# Altium project Lumos_Probe.PrjPcb
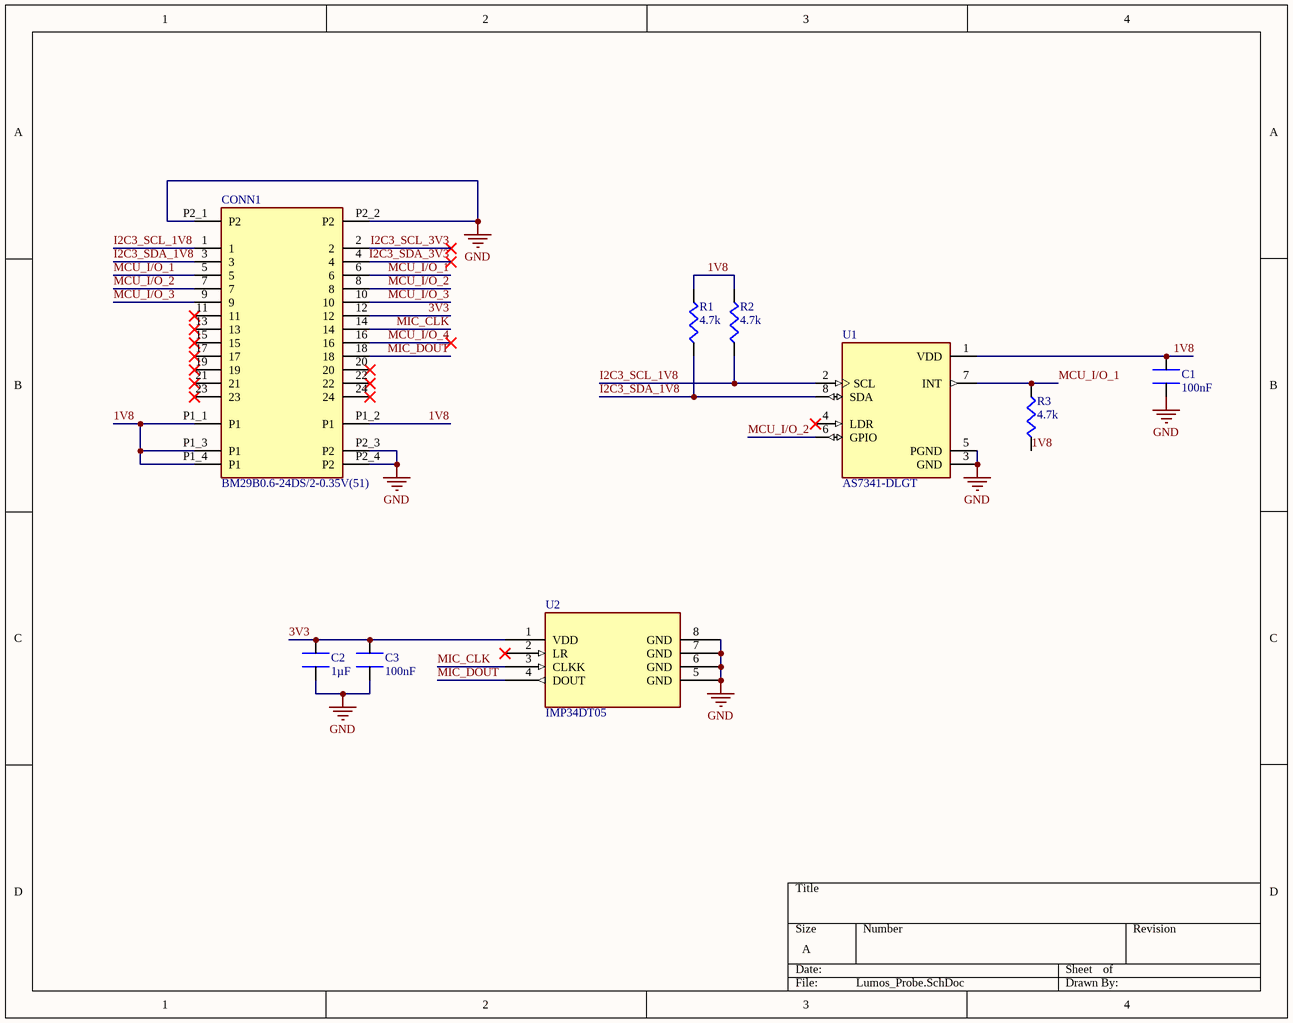
[diagram p0: Lumos_Probe.SchDoc]
1 sheet, 9 parts. Net scope: global (net labels, ports and power ports of the same name join across sheets).
Board file: Lumos_Probe.PcbDoc

## Sheet Lumos_Probe.SchDoc
size A; SheetNumber: 1; SheetTotal: 1

### Parts
C1  value 100nF  [Chip2PinSM127P600-8N]  (hidden comment: 0402YC104JAT4A)
C2  value 1µF  [Chip2PinSM127P600-8N]  (hidden comment: 0402YD105KAT4A)
C3  value 100nF  [Chip2PinSM127P600-8N]  (hidden comment: 0402YC104JAT4A)
CONN1  BM29B0.6-24DS/2-0.35V(51)  [BM29B0.6-24DS_2-0.35V(51)-Footprint-1]
R1  value 4.7k  [Chip2PinSM127P600-8N]  (hidden comment: CR0201-JW-472GLF)
R2  value 4.7k  [Chip2PinSM127P600-8N]  (hidden comment: CR0201-JW-472GLF)
R3  value 4.7k  [Chip2PinSM127P600-8N]  (hidden comment: CR0201-JW-472GLF)
U1  AS7341-DLGT  [PSON80P310X200X110-8N]
U2  IMP34DT05  [HCLGA_3X4X1_STM]

### Nets
GND: C1.2 C2.2 C3.2 CONN1.P2_1(P2) CONN1.P2_2(P2) CONN1.P2_3(P2) CONN1.P2_4(P2) U1.3(GND) U1.5(PGND) U2.5(GND) U2.6(GND) U2.7(GND) U2.8(GND)
1V8: C1.1 CONN1.P1_1(P1) CONN1.P1_2(P1) CONN1.P1_3(P1) CONN1.P1_4(P1) R1.1 R2.1 R3.1 U1.1(VDD)
3V3: C2.1 C3.1 CONN1.12 U2.1(VDD)
I2C3_SCL_1V8: CONN1.1 R2.2 U1.2(SCL)
I2C3_SCL_3V3: CONN1.2
I2C3_SDA_1V8: CONN1.3 R1.2 U1.8(SDA)
I2C3_SDA_3V3: CONN1.4
MCU_I/O_1: CONN1.5 CONN1.6 R3.2 U1.7(INT)
MCU_I/O_2: CONN1.7 CONN1.8 U1.6(GPIO)
MCU_I/O_3: CONN1.9 CONN1.10
MCU_I/O_4: CONN1.16
MIC_CLK: CONN1.14 U2.3(CLKK)
MIC_DOUT: CONN1.18 U2.4(DOUT)

Not connected (* = marked no-connect by the designer): CONN1 11* 13* 15* 17* 19* 20* 21* 22* 23* 24*; U1 4(LDR)*; U2 2(LR)*

### Library data of the parts
C1 C3 = CMP-00047-1: Ceramic Capacitor, Multilayer, Ceramic, 16V, 5% +Tol, 5% -Tol, X7R, 15% TC, 0.1uF, Surface Mount, 0402; Manufacturer: KYOCERA AVX; Multilayer: Yes; Rated DC Voltage (URdc): 16V; Tolerance  (fill in as +-): 5%; Dielectric Material: Ceramic; Reach SVHC Compliant: Yes; Package Style: SMTMeter; Mounting Technology: Surface Mount; Length: 1mm; Termination: Wraparound; Min Operating Temperature: -55°C; Width: 0.5mm; Tolerance (fill in as +-): 5%; Case/Package: 0402; Capacitor Type: Ceramic; RoHS Compliant: Yes; JESD-609 Code: e3; Max Operating Temperature: 125°C; Height: 0.56mm; Pins: 2; Package Shape: Rectangular; Packaging: Tape and Reel; Temperature Characteristics Code: X7R; Terminal Finish: Nickel; Manufacturer Part Number: 0402YC104JAT4A; Component Type: Capacitors; Supplier 1: Avnet; Supplier Part Number 1: KGM05AR71C104JN
C2 = CMP-001-00107-6: Ceramic Capacitor, Multilayer, Ceramic, 16V, 10% +Tol, 10% -Tol, X5R, 15% TC, 1uF, Surface Mount, 0402; Manufacturer: KYOCERA AVX; Min Operating Temperature: -55°C; RoHS Compliant: Yes; Case/Package: 0402; Pins: 2; Mounting Technology: Surface Mount; Max Operating Temperature: 85°C; Capacitor Type: Ceramic; Manufacturer Part Number: 0402YD105KAT4A; Component Type: Capacitors; Supplier 1: Avnet; Supplier Part Number 1: KGM05AR51C105KN
CONN1 = CMP-002-00106-1: Connector Receptacle 26 Pos (24+2) SMD; Manufacturer: HIROSE ELECTRIC; Manufacturer Part Number: BM29B0.6-24DS/2-0.35V(51); Component Type: Connectors; Supplier 1: DigiKey; Supplier Part Number 1: 26-BM29B0.6-24DS/2-0.35V(53)CT-ND
R1-R3 = CMP-00117-1: Fixed Resistor, Metal Glaze/thick Film, 0.05W, 4700ohm, 30V, 5% +/-Tol, 200ppm/Cel, Surface Mount, 0201; Manufacturer: Bourns; Temperature Coefficient: 200ppm/°C; Working Voltage: 25V; Rated Temperature: 70°C; Package Height: 0.23mm; Power: 50mW; Package Width: 0.3mm; Package Length: 0.6mm; Max Operating Temperature: 125°C; Construction: Chip; Technology: RUTHENIUM OXIDE; Min Operating Temperature: -55°C; Terminal Finish: Nickel; Packaging: Tape and Reel; Pins: 2; Tolerance: 5%; Termination: Wraparound; Package Style: SMTMeter; Reach SVHC Compliant: Yes; Mounting Technology: Surface Mount; Package Shape: Rectangular; JESD-609 Code: e3; Case/Package: 0201; Resistor Type: FIXED RESISTOR; RoHS Compliant: Yes; Manufacturer Part Number: CR0201-JW-472GLF; Component Type: Resistors; Supplier 1: DigiKey; Supplier Part Number 1: 118-CR0201-JW-472GLFCT-ND
U1 = AS7341-DLGT: Optical Sensor Ambient - IÂ²C 8-TFLGA; MF: ams; Package: TFLGA-8 ams; Purchase-URL: https://pricing.snapeda.com/search/part/AS7341-DLGT/?ref=eda; Availability: In Stock; MP: AS7341-DLGT; Check_prices: https://www.snapeda.com/parts/AS7341-DLGT/ams/view-part/?ref=eda; SnapEDA_Link: https://www.snapeda.com/parts/AS7341-DLGT/ams/view-part/?ref=snap; Price: None; Supplier 1: Farnell; Supplier Part Number 1: 4328201; Value: *
U2 = IMP34DT05: MEMS audio sensor omnidirectional digital microphone for industrial applications; Manufacturer_Name: STMicroelectronics; Copyright: Copyright (C) 2025 Ultra Librarian. All rights reserved.; Manufacturer_Part_Number: IMP34DT05; RefDes: RefDes; Type: Type; Supplier 1: Farnell; Supplier Part Number 1: 2980886